# EAGLE design 8led (EAGLE 5.10)
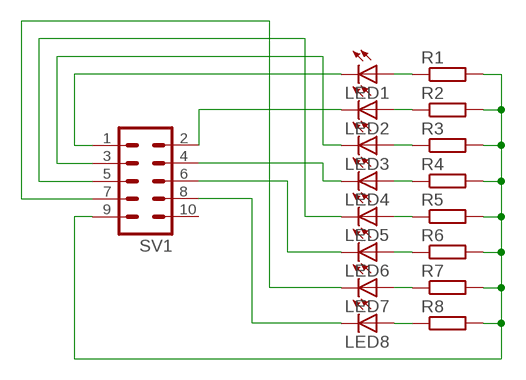
[diagram p0: schematic, sheet 1]

## Parts
LED1  LEDCHIPLED_0805  [CHIPLED_0805]
LED2  LEDCHIPLED_0805  [CHIPLED_0805]
LED3  LEDCHIPLED_0805  [CHIPLED_0805]
LED4  LEDCHIPLED_0805  [CHIPLED_0805]
LED5  LEDCHIPLED_0805  [CHIPLED_0805]
LED6  LEDCHIPLED_0805  [CHIPLED_0805]
LED7  LEDCHIPLED_0805  [CHIPLED_0805]
LED8  LEDCHIPLED_0805  [CHIPLED_0805]
R1  R-EU_R0805  [R0805]
R2  R-EU_R0805  [R0805]
R3  R-EU_R0805  [R0805]
R4  R-EU_R0805  [R0805]
R5  R-EU_R0805  [R0805]
R6  R-EU_R0805  [R0805]
R7  R-EU_R0805  [R0805]
R8  R-EU_R0805  [R0805]
SV1  MA05-2  [MA05-2]

## Nets
N$1: LED1.A R1.1
N$2: LED2.A R2.1
N$3: LED3.A R3.1
N$4: LED4.A R4.1
N$5: LED5.A R5.1
N$6: LED6.A R6.1
N$7: LED7.A R7.1
N$8: LED8.A R8.1
N$9: R1.2 R2.2 R3.2 R4.2 R5.2 R6.2 R7.2 R8.2 SV1.9
N$11: LED1.C SV1.1
N$12: LED2.C SV1.2
N$13: LED3.C SV1.3
N$14: LED4.C SV1.4
N$15: LED5.C SV1.5
N$16: LED6.C SV1.6
N$17: LED7.C SV1.7
N$18: LED8.C SV1.8
Unconnected: SV1.10

## Library data of the parts
LED1-LED8 = led:LED: LED OSRAM: - CHIPLED LG R971, LG N971, LY N971, LG Q971, LY Q971, LO R971, LY R971 LH N974, LH R974 LS Q976, LO Q976, LY Q976 LO Q996 - Hyper CHIPLED LW Q18S LB Q993, LB Q99A, LB R99A - SideLED LS A670, LO A670, LY A670, LG A670, LP A670 LB A673, LV A673, LT A673, LW A673 LH A674 LY A675 LS A676, LA A676, LO A676, LY A676, LW A676 LS A679, LY A679, LG A679 - Hyper Micro SIDELED® LS Y876, LA Y876, LO Y876, LY Y876 LT Y87S - SmartLED LW L88C, LW L88S LB L89C, LB L89S, LG L890 LS L89K, LO L89K, LY L89K LS L896, LA L896, LO L896, LY L896 - TOPLED LS T670, LO T670, LY T670, LG T670, LP T670 LSG T670, LSP T670, LSY T670, LOP T670, LYG T670 LG T671, LOG T671, LSG T671 LB T673, LV T673, LT T673, LW T673 LH T674 LS T676, LA T676, LO T676, LY T676, LB T676, LH T676, LSB T676, LW T676 LB T67C, LV T67C, LT T67C, LS T67K, LO T67K, LY T67K, LW E67C LS E67B, LA E67B, LO E67B, LY E67B, LB E67C, LV E67C, LT E67C LW T67C LS T679, LY T679, LG T679 LS T770, LO T770, LY T770, LG T770, LP T770 LB T773, LV T773, LT T773, LW T773 LH T774 LS E675, LA E675, LY E675, LS T675 LS T776, LA T776, LO T776, LY T776, LB T776 LHGB T686 LT T68C, LB T68C - Hyper Mini TOPLED® LB M676 - Mini TOPLED Santana® LG M470 LS M47K, LO M47K, LY M47K Source: http://www.osram.convergy.de LUXEON: - LUMILED® LXK2-PW12-R00, LXK2-PW12-S00, LXK2-PW14-U00, LXK2-PW14-V00 LXK2-PM12-R00, LXK2-PM12-S00, LXK2-PM14-U00 LXK2-PE12-Q00, LXK2-PE12-R00, LXK2-PE12-S00, LXK2-PE14-T00, LXK2-PE14-U00 LXK2-PB12-K00, LXK2-PB12-L00, LXK2-PB12-M00, LXK2-PB14-N00, LXK2-PB14-P00, LXK2-PB14-Q00 LXK2-PR12-L00, LXK2-PR12-M00, LXK2-PR14-Q00, LXK2-PR14-R00 LXK2-PD12-Q00, LXK2-PD12-R00, LXK2-PD12-S00 LXK2-PH12-R00, LXK2-PH12-S00 LXK2-PL12-P00, LXK2-PL12-Q00, LXK2-PL12-R00 Source: www.luxeon.com KINGBRIGHT: KA-3528ASYC Source: www.kingbright.com
R1-R8 = rcl:R-EU_: RESISTOR, European symbol
SV1 = con-lstb:MA05-2: PIN HEADER

## Board
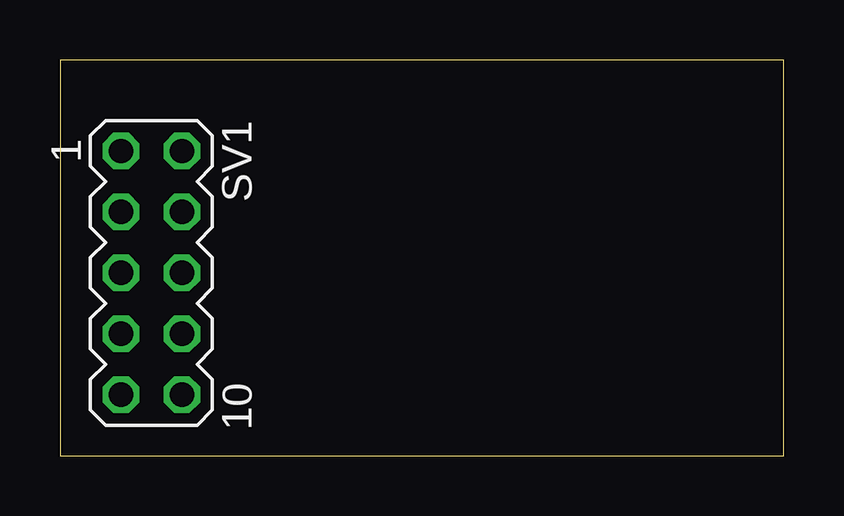
[diagram p1: board, top side]
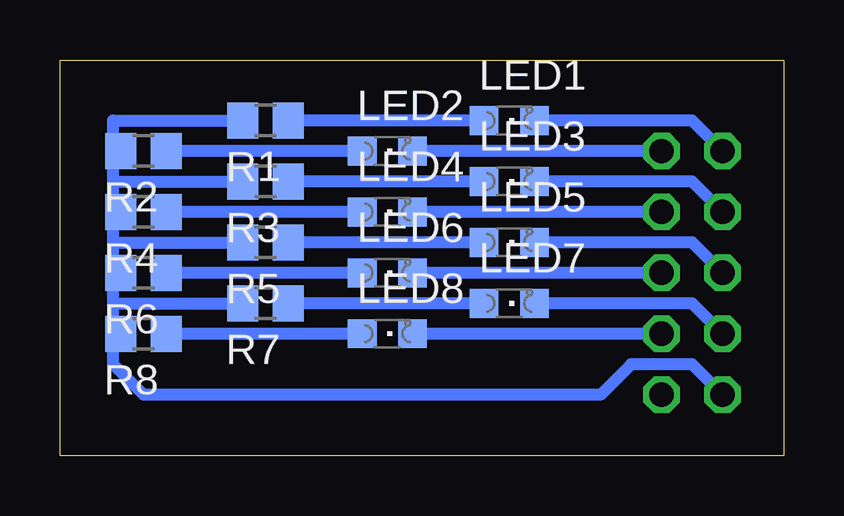
[diagram p2: board, bottom side, seen from below]

Size 30.15 x 16.5 mm. Coordinates in mm from the lower left corner, seen from the top.
Outline: 0,0 30.15,0 30.15,16.5 0,16.5 0,0
Copper layers (1*16): Top 0.035mm / dielectric 1.5mm / Bottom 0.035mm
Design rules "dimka": minimum track width 10mil, minimum drill 20mil, track to track 10mil, track to pad 10mil, pad to pad 10mil, via to via 10mil, smd to smd 10mil, copper to edge 10mil, drill to drill 10mil, minimum pad ring 10mil, minimum via ring 10mil, stop-mask expansion 4mil, vias tented up to drill 0mil, thermal gap 10mil

### Footprints (pad centres in the part's own frame; a part is rotated, then mirrored left to right if it is on the bottom)
CHIPLED_0805 = smd 1.2 x 1.2: A 0,-1.05; C 0,1.05
R0805 = smd 1.3 x 1.5: 1 -0.95,0; 2 0.95,0
MA05-2 = drill 1.016 octagon: 1 -5.08,-1.27; 2 -5.08,1.27; 3 -2.54,-1.27; 4 -2.54,1.27; 5 0,-1.27; 6 0,1.27; 7 2.54,-1.27; 8 2.54,1.27; 9 5.08,-1.27; 10 5.08,1.27

### Placement (x,y rotation side)
LED1  11.43,13.97 270 bottom
LED2  16.51,12.7 270 bottom
LED3  11.43,11.43 270 bottom
LED4  16.51,10.16 270 bottom
LED5  11.43,8.89 270 bottom
LED6  16.51,7.62 270 bottom
LED7  11.43,6.35 270 bottom
LED8  16.51,5.08 270 bottom
R1  21.59,13.97 180 bottom
R2  26.67,12.7 180 bottom
R3  21.59,11.43 180 bottom
R4  26.67,10.16 180 bottom
R5  21.59,8.89 180 bottom
R6  26.67,7.62 180 bottom
R7  21.59,6.35 180 bottom
R8  26.67,5.08 180 bottom
SV1  3.81,7.62 270 top

### Tracks (layer width: path | path; a pad name or v marks a point on that pad's centre or on a via)
N$1
  Bottom 0.508: LED1.A R1.1
N$2
  Bottom 0.508: LED2.A R2.1
N$3
  Bottom 0.508: LED3.A R3.1
N$4
  Bottom 0.508: LED4.A R4.1
N$5
  Bottom 0.508: LED5.A R5.1
N$6
  Bottom 0.508: LED6.A R6.1
N$7
  Bottom 0.508: LED7.A R7.1
N$8
  Bottom 0.508: LED8.A R8.1
N$9
  Bottom 0.508: SV1.9 3.81,3.81 6.35,3.81 7.62,2.54 26.67,2.54 27.94,3.81 27.94,4.76 R8.2 27.94,5.4 27.94,6.35 | R1.2 27.94,13.97 27.94,13.02 R2.2 27.94,12.38 27.94,11.43 | 27.94,11.43 R3.2 | 27.94,8.89 R5.2 | 27.94,6.35 R7.2 | 27.94,11.43 27.94,10.48 R4.2 27.94,9.84 27.94,8.89 | 27.94,6.35 27.94,7.3 R6.2 27.94,7.94 27.94,8.89
N$11
  Bottom 0.508: SV1.1 3.81,13.97 LED1.C
N$12
  Bottom 0.508: SV1.2 LED2.C
N$13
  Bottom 0.508: SV1.3 3.81,11.43 LED3.C
N$14
  Bottom 0.508: SV1.4 LED4.C
N$15
  Bottom 0.508: SV1.5 3.81,8.89 LED5.C
N$16
  Bottom 0.508: SV1.6 LED6.C
N$17
  Bottom 0.508: SV1.7 3.81,6.35 LED7.C
N$18
  Bottom 0.508: SV1.8 LED8.C